# Altium schematic sheet P1.schdoc
size 297 x 209 mm; Symbol: Drawing-Symbol_A4; @Project Name: New Project_2026-08-24_15-33-29; @Page Count: 1; @Update Date: 2026-08-24; @Create Date: 2026-08-24; @Schematic Name: Schematic1; @Page No: 1; @Page Name: P1; Company: EasyEDA.com; Version: V1.0; Page Size: A4; Device: Drawing-Symbol_A4; @Create Time: 15:33:45; @Update Time: 15:33:45; Border: 1; Width: 1170; Height: 825; Region Start: 1; X Region Count: 6; Y Region Count: 4; Blade Width: 10; Title Block Position: 3; @Board Name: Board1
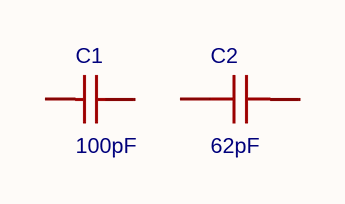
[diagram p0: P1.schdoc]

## Parts
C1  100pF  [C0603]
C2  62pF  [C0603]

## Nets

Not connected (* = marked no-connect by the designer): C1 1 2; C2 1 2

## Notes on the sheet
- Create at
- 2026-08-24
- Schematic
- Board
- Schematic1
- Board1
- Update at
- Page
- P1
- Drawn
- Reviewed
- New Project_2026-08-24_15-33-29
- Version
- V1.0
- Size
- A4
- Page  1  Total  1
- EasyEDA.com

## Library data of the parts
C1 = CL10C101JB8NNNC: Capacitance:100pF Tolerance:±5% Tolerance:±5% Voltage Rating:50V Temperature Coefficient:C0G; Manufacturer: SAMSUNG(三星); AddInBom: yes; ModelId: 624118aa3cc7497086c383c2d72e08520819f05c4eef4c71ace90d822a990e87; ModelName: C0603_L1.6-W0.8-H0.8; ModelTransform: 62.992,31.496,0,0,0,0,0,0,0; Tolerance: ±5%; Voltage Rating: 50V; Temperature Coefficient: C0G; Symbol: CL10C101JB8NNNC; Device: CL10C101JB8NNNC; LCSC Part Name: 100pF ±5% 50V; SupplierPart: C14858; ManufacturerPart: CL10C101JB8NNNC; Supplier Footprint: 0603; JLCPCB Part Class: Basic Part; Datasheet: https://item.szlcsc.com/datasheet/CL10C101JB8NNNC/15530.html; Supplier: LCSC; ConvertToPcb: yes; FootprintName: C0603; Value: 100pF
C2 = 0603CG620J500NT: Capacitance:62pF Tolerance:±5% Tolerance:±5% Voltage Rating:50V Temperature Coefficient:C0G; Manufacturer: FH(风华); AddInBom: yes; ModelId: 624118aa3cc7497086c383c2d72e08520819f05c4eef4c71ace90d822a990e87; ModelName: C0603_L1.6-W0.8-H0.8; ModelTransform: 62.992,31.496,0,0,0,0,0,0,0; Tolerance: ±5%; Voltage Rating: 50V; Temperature Coefficient: C0G; Symbol: 0603CG620J500NT; Device: 0603CG620J500NT; LCSC Part Name: 62pF ±5% 50V; SupplierPart: C60732; ManufacturerPart: 0603CG620J500NT; Supplier Footprint: 0603; JLCPCB Part Class: Extended Part; Datasheet: https://item.szlcsc.com/datasheet/0603CG620J500NT/61784.html; Supplier: LCSC; ConvertToPcb: yes; FootprintName: C0603; Value: 62pF